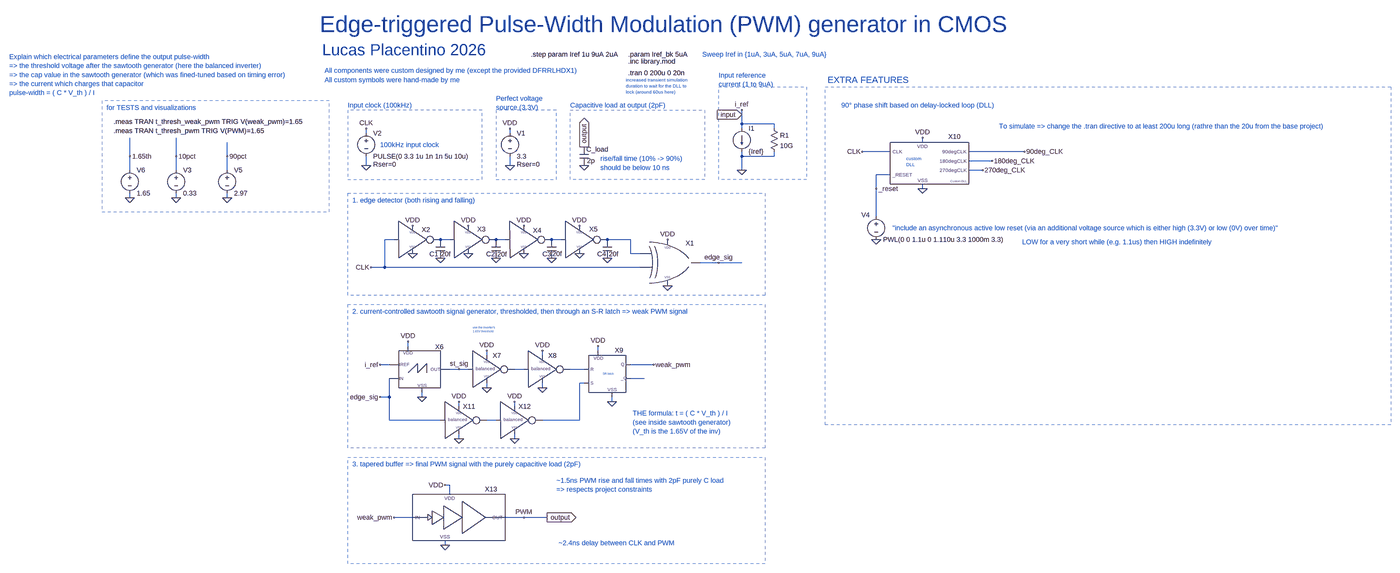
[diagram p0: schematic edge-triggered_PWM_generator.asc, whole sheet]
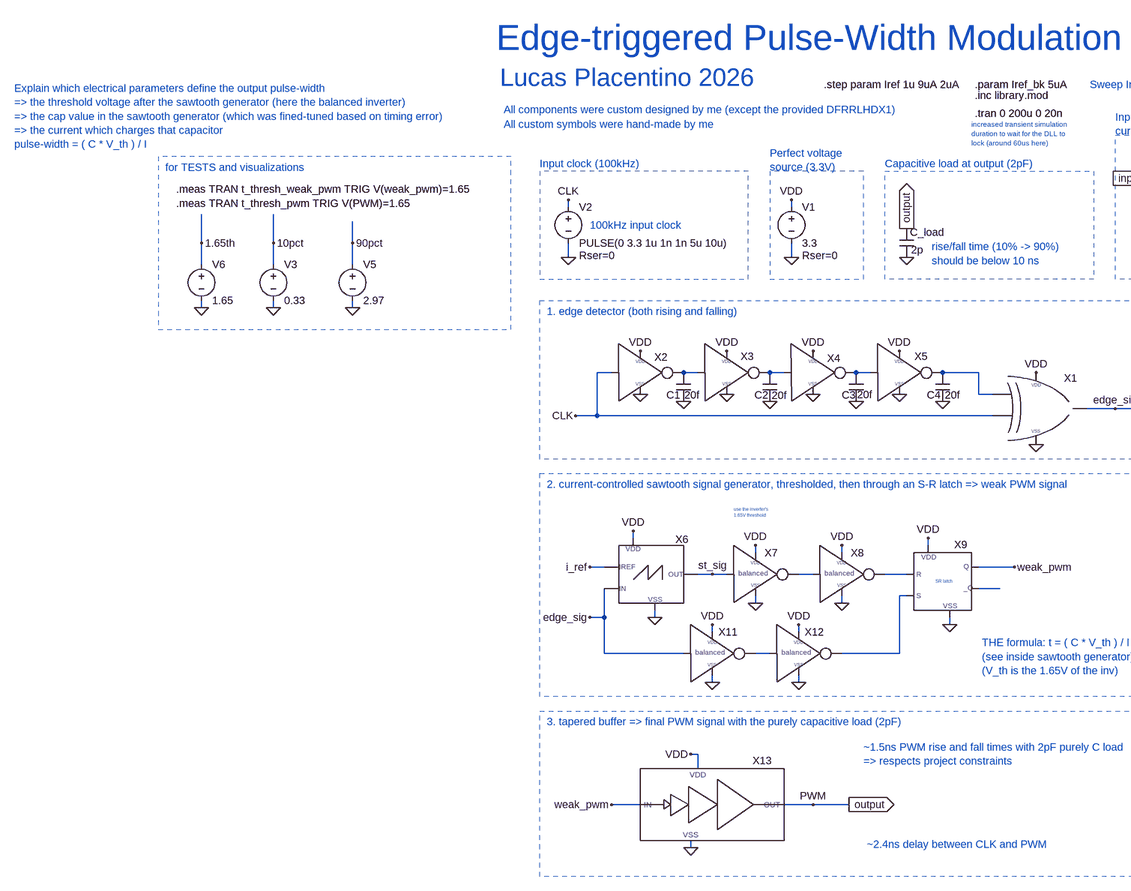
[diagram p1: schematic edge-triggered_PWM_generator.asc, part, row 1 of 1, column 1 of 2]
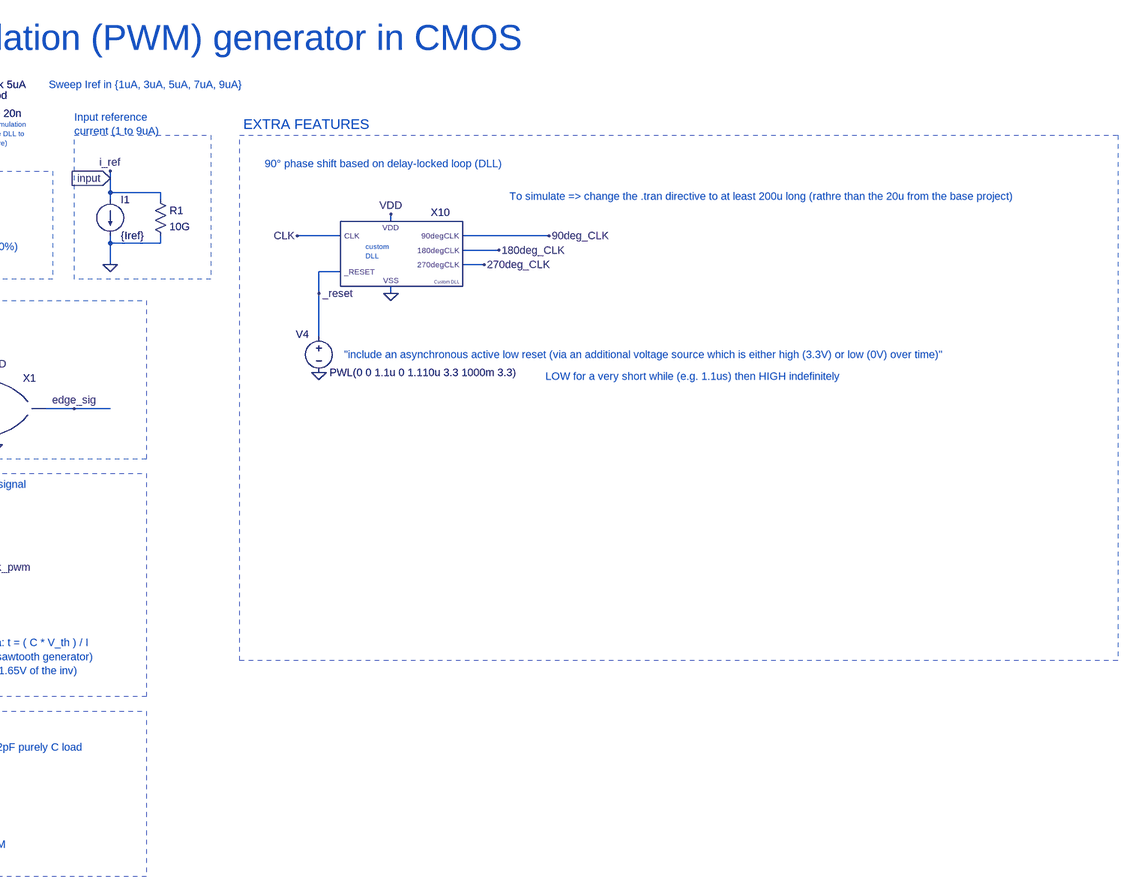
[diagram p2: schematic edge-triggered_PWM_generator.asc, part, row 1 of 1, column 2 of 2]
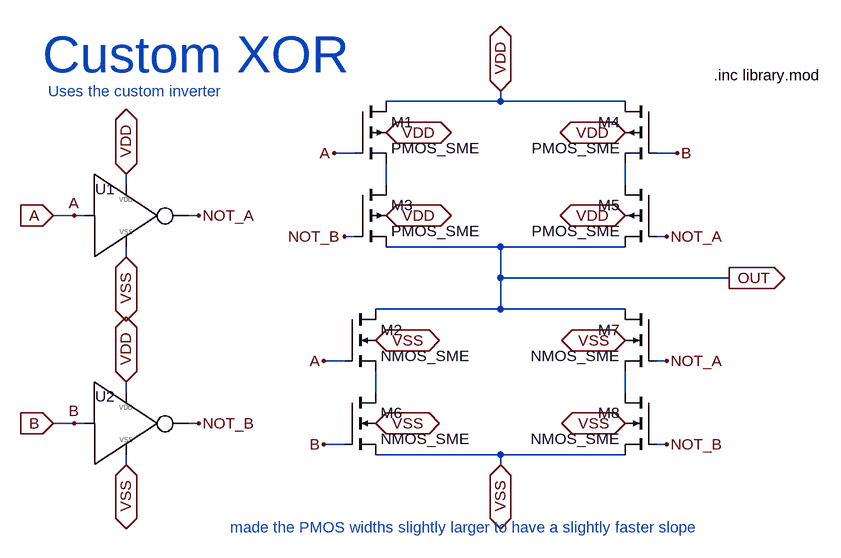
[diagram p3: sub-circuit my_xor.asc]
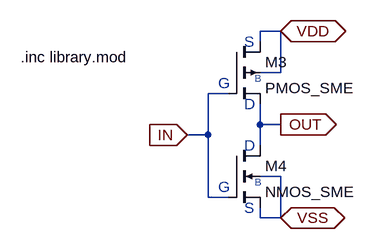
[diagram p4: sub-circuit my_inverter.asc]
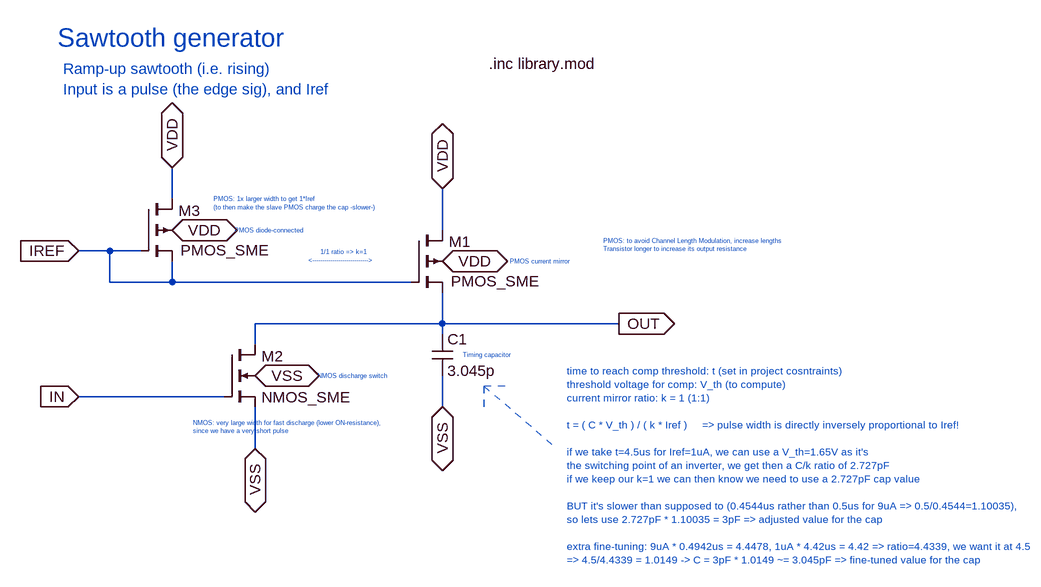
[diagram p5: sub-circuit my_sawtooth_gen.asc]
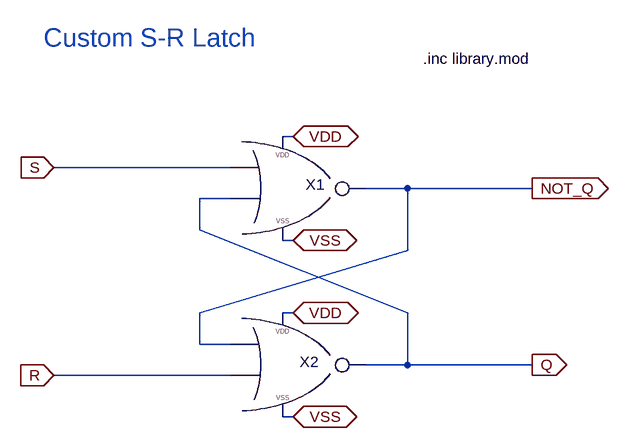
[diagram p6: sub-circuit my_sr_latch.asc]
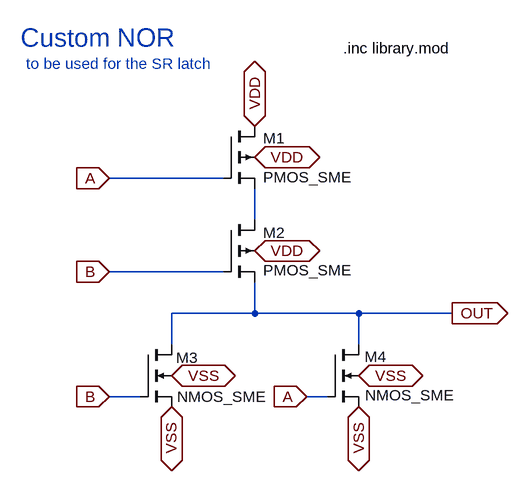
[diagram p7: sub-circuit my_nor.asc]
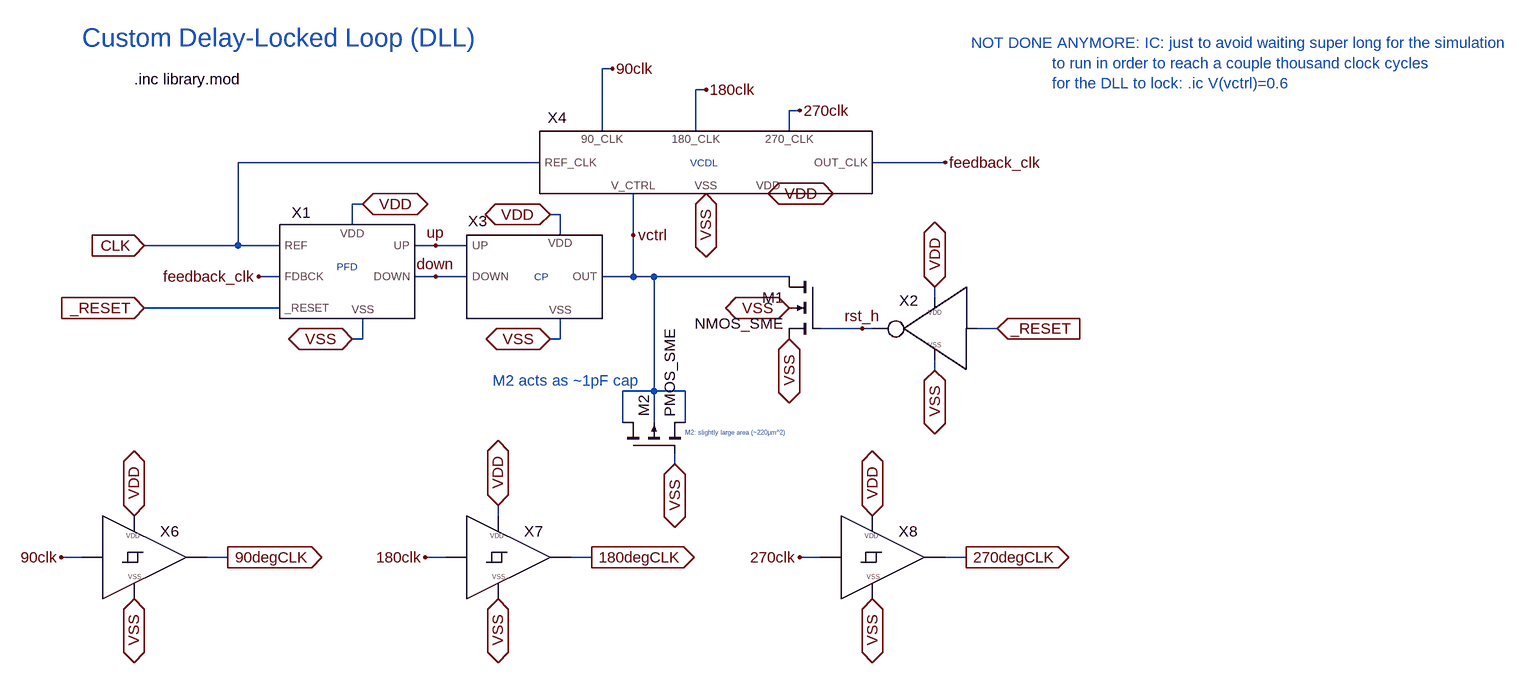
[diagram p8: sub-circuit my_dll.asc]
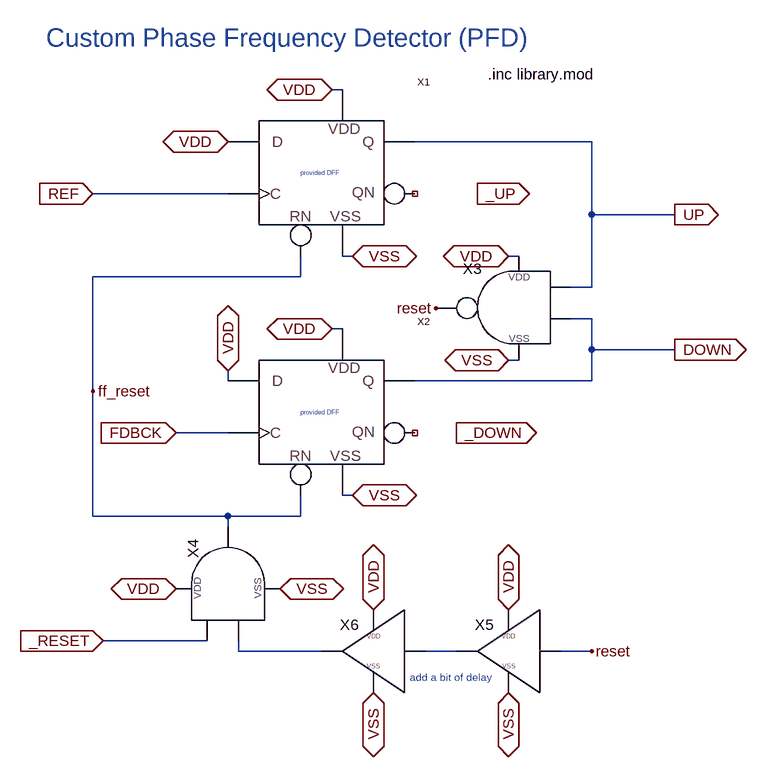
[diagram p9: sub-circuit my_pfd.asc]
edge-triggered_PWM_generator.asc, the LTspice schematic file:
Version 4.1
SHEET 1 2368 1332
WIRE -80 -256 -80 -272
WIRE -80 -224 -80 -256
WIRE 32 -224 -80 -224
WIRE -80 -208 -80 -224
WIRE 32 -208 32 -224
WIRE -1376 -192 -1376 -208
WIRE -880 -192 -880 -208
WIRE 544 -160 544 -176
WIRE 432 -128 336 -128
WIRE 896 -128 704 -128
WIRE -2192 -112 -2192 -176
WIRE -2032 -112 -2032 -176
WIRE -1856 -112 -1856 -160
WIRE -80 -112 -80 -128
WIRE 32 -112 32 -128
WIRE 32 -112 -80 -112
WIRE 784 -96 704 -96
WIRE -1376 -80 -1376 -112
WIRE -880 -80 -880 -112
WIRE -2192 -64 -2192 -112
WIRE -2032 -64 -2032 -112
WIRE -1856 -64 -1856 -112
WIRE -80 -64 -80 -112
WIRE 752 -64 704 -64
WIRE 432 -48 384 -48
WIRE 384 0 384 -48
WIRE 544 0 544 -16
WIRE -2192 32 -2192 16
WIRE -2032 32 -2032 16
WIRE -1856 32 -1856 16
WIRE 384 96 384 0
WIRE -1280 176 -1312 176
WIRE -1088 176 -1120 176
WIRE -896 176 -928 176
WIRE -704 176 -736 176
WIRE -464 176 -544 176
WIRE -464 224 -464 176
WIRE -432 224 -464 224
WIRE -160 256 -224 256
WIRE -80 256 -160 256
WIRE -1312 272 -1312 176
WIRE -1312 272 -1360 272
WIRE -432 272 -1312 272
WIRE -1232 544 -1232 528
WIRE -576 560 -576 544
WIRE -960 576 -960 560
WIRE -768 576 -768 560
WIRE -1296 608 -1328 608
WIRE -384 608 -464 608
WIRE -1056 624 -1088 624
WIRE -1024 624 -1056 624
WIRE -832 624 -864 624
WIRE -624 624 -672 624
WIRE -416 656 -464 656
WIRE -624 672 -640 672
WIRE -960 688 -960 672
WIRE -768 688 -768 672
WIRE -1296 720 -1296 656
WIRE -1296 720 -1328 720
WIRE -1184 720 -1184 704
WIRE -528 736 -528 720
WIRE -1056 752 -1056 736
WIRE -864 752 -864 736
WIRE -1296 800 -1296 720
WIRE -1120 800 -1296 800
WIRE -928 800 -960 800
WIRE -640 800 -640 672
WIRE -640 800 -768 800
WIRE -1056 864 -1056 848
WIRE -864 864 -864 848
WIRE -1088 1024 -1104 1024
WIRE -1088 1056 -1088 1024
WIRE -1216 1136 -1280 1136
WIRE -832 1136 -896 1136
WIRE -752 1136 -832 1136
WIRE -1104 1232 -1104 1216
FLAG -880 -80 0
FLAG -880 -208 VDD
FLAG -1376 -80 0
FLAG -1376 -208 CLK
FLAG -624 -80 0
FLAG -624 -144 output
IOPIN -624 -144 Out
FLAG -80 -256 input
IOPIN -80 -256 In
FLAG -832 224 0
FLAG -640 224 0
FLAG -336 336 0
FLAG -1024 224 0
FLAG -1216 224 0
FLAG -640 128 VDD
FLAG -832 128 VDD
FLAG -1024 128 VDD
FLAG -1216 128 VDD
FLAG -336 176 VDD
FLAG -1360 272 CLK
FLAG -160 256 edge_sig
FLAG -1120 240 0
FLAG -928 240 0
FLAG -736 240 0
FLAG -544 240 0
FLAG -1232 528 VDD
FLAG -1184 720 0
FLAG -960 560 VDD
FLAG -960 688 0
FLAG -80 -272 i_ref
FLAG -80 -64 0
FLAG -1328 608 i_ref
FLAG -1056 624 st_sig
FLAG -1328 720 edge_sig
FLAG -576 544 VDD
FLAG -528 736 0
FLAG -384 608 weak_pwm
FLAG -768 560 VDD
FLAG -768 688 0
FLAG -1280 1136 weak_pwm
FLAG 544 -176 VDD
FLAG 544 0 0
FLAG 336 -128 CLK
FLAG 896 -128 90deg_CLK
FLAG 784 -96 180deg_CLK
FLAG 752 -64 270deg_CLK
FLAG -752 1136 output
IOPIN -752 1136 Out
FLAG 384 0 _reset
FLAG 384 176 0
FLAG -1056 736 VDD
FLAG -1056 864 0
FLAG -864 736 VDD
FLAG -864 864 0
FLAG -1104 1232 0
FLAG -1104 1024 VDD
FLAG -2032 32 0
FLAG -1856 32 0
FLAG -1856 -112 90pct
FLAG -2032 -112 10pct
FLAG -832 1136 PWM
FLAG -2192 32 0
FLAG -2192 -112 1.65th
SYMBOL current -80 -208 R0
WINDOW 123 0 0 Left 0
WINDOW 39 0 0 Left 0
SYMATTR InstName I1
SYMATTR Value {Iref}
SYMBOL voltage -880 -208 R0
WINDOW 123 0 0 Left 0
WINDOW 39 24 124 Left 2
SYMATTR SpiceLine Rser=0
SYMATTR InstName V1
SYMATTR Value 3.3
SYMBOL res 16 -224 R0
SYMATTR InstName R1
SYMATTR Value 10G
SYMBOL voltage -1376 -208 R0
WINDOW 123 0 0 Left 0
WINDOW 39 24 124 Left 2
SYMATTR SpiceLine Rser=0
SYMATTR InstName V2
SYMATTR Value PULSE(0 3.3 1u 1n 1n 5u 10u)
SYMBOL cap -640 -144 R0
WINDOW 3 26 47 Left 2
SYMATTR Value 2p
SYMATTR InstName C_load
SYMBOL my_xor -320 256 R0
SYMATTR InstName X1
SYMBOL my_inverter -1216 176 R0
WINDOW 0 46 -19 Bottom 2
SYMATTR InstName X2
SYMBOL my_inverter -1024 176 R0
WINDOW 0 46 -20 Bottom 2
SYMATTR InstName X3
SYMBOL my_inverter -832 176 R0
WINDOW 0 46 -16 Bottom 2
SYMATTR InstName X4
SYMBOL my_inverter -640 176 R0
WINDOW 0 48 -20 Bottom 2
SYMATTR InstName X5
SYMBOL cap -1136 176 R0
WINDOW 0 -22 50 Left 2
WINDOW 3 18 50 Left 2
SYMATTR InstName C1
SYMATTR Value 20f
SYMBOL cap -944 176 R0
WINDOW 0 -18 50 Left 2
WINDOW 3 20 51 Left 2
SYMATTR InstName C2
SYMATTR Value 20f
SYMBOL cap -752 176 R0
WINDOW 0 -16 50 Left 2
WINDOW 3 18 49 Left 2
SYMATTR InstName C3
SYMATTR Value 20f
SYMBOL cap -560 176 R0
WINDOW 0 -19 50 Left 2
WINDOW 3 21 50 Left 2
SYMATTR InstName C4
SYMATTR Value 20f
SYMBOL my_sawtooth_gen -1200 624 R0
SYMATTR InstName X6
SYMBOL my_sr_latch -544 640 R0
WINDOW 0 41 -66 Bottom 2
SYMATTR InstName X9
SYMBOL voltage 384 80 R0
WINDOW 0 -51 11 Left 2
WINDOW 123 0 0 Left 0
WINDOW 39 0 0 Left 0
SYMATTR InstName V4
SYMATTR Value PWL(0 0 1.1u 0 1.110u 3.3 1000m 3.3)
SYMBOL my_dll 560 -96 R0
SYMATTR InstName X10
SYMBOL my_balanced_inverter -960 624 R0
WINDOW 0 35 -32 Bottom 2
SYMATTR InstName X7
SYMBOL my_balanced_inverter -768 624 R0
WINDOW 0 35 -32 Bottom 2
SYMATTR InstName X8
SYMBOL my_balanced_inverter -1056 800 R0
WINDOW 0 35 -32 Bottom 2
SYMATTR InstName X11
SYMBOL my_balanced_inverter -864 800 R0
WINDOW 0 35 -32 Bottom 2
SYMATTR InstName X12
SYMBOL my_tapered_buffer -1056 1136 R0
SYMATTR InstName X13
SYMBOL voltage -2032 -80 R0
SYMATTR InstName V3
SYMATTR Value 0.33
SYMBOL voltage -1856 -80 R0
SYMATTR InstName V5
SYMATTR Value 2.97
SYMBOL voltage -2192 -80 R0
SYMATTR InstName V6
SYMATTR Value 1.65
TEXT -472 -464 Left 2 !.param Iref_bk 5uA
TEXT -472 -440 Left 2 !.inc library.mod
TEXT -472 -400 Left 2 !.tran 0 200u 0 20n
TEXT -1536 -568 Left 6 ;Edge-triggered Pulse-Width Modulation (PWM) generator in CMOS
TEXT -568 -104 Left 2 ;rise/fall time (10% -> 90%)\nshould be below 10 ns
TEXT -216 -464 Left 2 ;Sweep Iref in {1uA, 3uA, 5uA, 7uA, 9uA}
TEXT -2608 -456 Left 2 ;Explain which electrical parameters define the output pulse-width\n=> the threshold voltage after the sawtooth generator (here the balanced inverter)\n=> the cap value in the sawtooth generator (which was fined-tuned based on timing error)\n=> the current which charges that capacitor\npulse-width = ( C * V_th ) / I
TEXT -1328 -152 Left 2 ;100kHz input clock
TEXT -1528 -480 Left 5 ;Lucas Placentino 2026
TEXT -1424 40 Left 2 ;1. edge detector (both rising and falling)
TEXT -1424 424 Left 2 ;2. current-controlled sawtooth signal generator, thresholded, then through an S-R latch => weak PWM signal
TEXT -560 640 Left 0 ;SR latch
TEXT -1424 952 Left 2 ;3. tapered buffer => final PWM signal with the purely capacitive load (2pF)
TEXT -1440 -288 Left 2 ;Input clock (100kHz)
TEXT -928 -312 Left 2 ;Perfect voltage \nsource (3.3V)
TEXT -672 -288 Left 2 ;Capacitive load at output (2pF)
TEXT -160 -392 Left 2 ;Input reference \ncurrent (1 to 9uA)
TEXT 264 -288 Left 2 ;90° phase shift based on delay-locked loop (DLL)
TEXT 488 -104 Left 1 ;custom\nDLL
TEXT 216 -376 Left 3 ;EXTRA FEATURES
TEXT 440 136 Left 2 ;"include an asynchronous active low reset (via an additional voltage source which is either high (3.3V) or low (0V) over time)"
TEXT -1008 480 Left 0 ;use the inverter's\n1.65V threshold
TEXT 888 184 Left 2 ;LOW for a very short while (e.g. 1.1us) then HIGH indefinitely
TEXT -808 -464 Left 2 !.step param Iref 1u 9uA 2uA
TEXT -2248 -232 Left 2 !.meas TRAN t_thresh_weak_pwm TRIG V(weak_pwm)=1.65
TEXT -456 776 Left 2 ;THE formula: t = ( C * V_th ) / I\n(see inside sawtooth generator)\n(V_th is the 1.65V of the inv)
TEXT -720 1008 Left 2 ;~1.5ns PWM rise and fall times with 2pF purely C load\n=> respects project constraints
TEXT -2272 -280 Left 2 ;for TESTS and visualizations
TEXT 808 -216 Left 2 ;To simulate => change the .tran directive to at least 200u long (rathre than the 20u from the base project)
TEXT -712 1224 Left 2 ;~2.4ns delay between CLK and PWM
TEXT -2248 -200 Left 2 !.meas TRAN t_thresh_pwm TRIG V(PWM)=1.65
TEXT -1520 -376 Left 2 ;All custom symbols were hand-made by me
TEXT -1520 -408 Left 2 ;All components were custom designed by me (except the provided DFRRLHDX1)
TEXT -480 -376 Left 1 ;increased transient simulation \nduration to wait for the DLL to\nlock (around 60us here)
RECTANGLE Normal -1440 -32 -976 -272 2
RECTANGLE Normal -208 -32 -672 -272 2
RECTANGLE Normal 144 -32 -160 -352 2
RECTANGLE Normal -928 -32 -720 -272 2
RECTANGLE Normal 0 368 -1440 16 2
RECTANGLE Normal 0 896 -1440 400 2
RECTANGLE Normal 2160 816 208 -352 2
RECTANGLE Normal 0 1296 -1440 928 2
RECTANGLE Normal -2288 80 -1504 -304 2

The netlist it stands for:
* edge-triggered_PWM_generator.asc
I1 i_ref 0 {Iref}
V1 VDD 0 3.3 Rser=0
R1 i_ref 0 10G
V2 CLK 0 PULSE(0 3.3 1u 1n 1n 5u 10u) Rser=0
C_load PWM 0 2p
X§X1 N004 CLK edge_sig VDD 0 my_xor
X§X2 CLK N001 VDD 0 my_inverter
X§X3 N001 N002 VDD 0 my_inverter
X§X4 N002 N003 VDD 0 my_inverter
X§X5 N003 N004 VDD 0 my_inverter
C1 N001 0 20f
C2 N002 0 20f
C3 N003 0 20f
C4 N004 0 20f
X§X6 edge_sig i_ref st_sig VDD 0 my_sawtooth_gen
X§X9 N006 N008 N007 weak_pwm VDD 0 my_sr_latch
V4 _reset 0 PWL(0 0 1.1u 0 1.110u 3.3 1000m 3.3)
X§X10 _reset CLK 180deg_CLK 270deg_CLK 90deg_CLK VDD 0 my_dll
X§X7 st_sig N005 VDD 0 my_balanced_inverter
X§X8 N005 N006 VDD 0 my_balanced_inverter
X§X11 edge_sig N009 VDD 0 my_balanced_inverter
X§X12 N009 N008 VDD 0 my_balanced_inverter
X§X13 weak_pwm PWM VDD 0 my_tapered_buffer
V3 10pct 0 0.33
V5 90pct 0 2.97
V6 1.65th 0 1.65

* block symbol definitions
.subckt my_xor A B OUT VDD VSS
M1 VDD A N001 VDD PMOS_SME l=0.35u w=1u
M2 OUT A N003 VSS NMOS_SME l=0.35u w=0.4u
X§U1 A NOT_A VDD VSS my_inverter
X§U2 B NOT_B VDD VSS my_inverter
M3 N001 NOT_B OUT VDD PMOS_SME l=0.35u w=1u
M4 VDD B N002 VDD PMOS_SME l=0.35u w=1u
M5 N002 NOT_A OUT VDD PMOS_SME l=0.35u w=1u
M6 N003 B VSS VSS NMOS_SME l=0.35u w=0.4u
M7 OUT NOT_A N004 VSS NMOS_SME l=0.35u w=0.4u
M8 N004 NOT_B VSS VSS NMOS_SME l=0.35u w=0.4u
* Custom XOR
* Uses the custom inverter
.inc library.mod
* made the PMOS widths slightly larger to have a slightly faster slope
.ends my_xor

.subckt my_inverter IN OUT VDD VSS
M3 VDD IN OUT VDD PMOS_SME l=0.35u w=0.4u
M4 OUT IN VSS VSS NMOS_SME l=0.35u w=0.4u
* S
* S
* D
* D
* G
* G
* B
* B
.inc library.mod
.ends my_inverter

.subckt my_sawtooth_gen IN IREF OUT VDD VSS
C1 OUT VSS 3.045p
M2 OUT IN VSS VSS NMOS_SME l=0.35u w=20u
M3 VDD IREF IREF VDD PMOS_SME l=10u w=2u
M1 VDD IREF OUT VDD PMOS_SME l=10u w=2u
* Sawtooth generator
* Ramp-up sawtooth (i.e. rising)
* Input is a pulse (the edge sig), and Iref
* PMOS current mirror
* Timing capacitor
* NMOS discharge switch
* PMOS diode-connected
.inc library.mod
* NMOS: very large width for fast discharge (lower ON-resistance),
* since we have a very short pulse
* PMOS: 1x larger width to get 1*Iref
* (to then make the slave PMOS charge the cap -slower-)
* PMOS: to avoid Channel Length Modulation, increase lengths
* Transistor longer to increase its output resistance
* time to reach comp threshold: t (set in project cosntraints)
* threshold voltage for comp: V_th (to compute)
* current mirror ratio: k = 1 (1:1)
* t = ( C * V_th ) / ( k * Iref )     => pulse width is directly inversely proportional to Iref!
* if we take t=4.5us for Iref=1uA, we can use a V_th=1.65V as it's
* the switching point of an inverter, we get then a C/k ratio of 2.727pF
* if we keep our k=1 we can then know we need to use a 2.727pF cap value
* BUT it's slower than supposed to (0.4544us rather than 0.5us for 9uA => 0.5/0.4544=1.10035),
* so lets use 2.727pF * 1.10035 = 3pF => adjusted value for the cap
* extra fine-tuning: 9uA * 0.4942us = 4.4478, 1uA * 4.42us = 4.42 => ratio=4.4339, we want it at 4.5
* => 4.5/4.4339 = 1.0149 -> C = 3pF * 1.0149 ~= 3.045pF => fine-tuned value for the cap
* 1/1 ratio => k=1
* <---------------------------->
.ends my_sawtooth_gen

.subckt my_sr_latch R S NOT_Q Q VDD VSS
X§X1 S Q NOT_Q VDD VSS my_nor
X§X2 NOT_Q R Q VDD VSS my_nor
* Custom S-R Latch
.inc library.mod
.ends my_sr_latch

.subckt my_nor A B OUT VDD VSS
M1 VDD A N001 VDD PMOS_SME l=0.35u w=0.4u
M2 N001 B OUT VDD PMOS_SME l=0.35u w=0.4u
M3 OUT B VSS VSS NMOS_SME l=0.35u w=0.4u
M4 OUT A VSS VSS NMOS_SME l=0.35u w=0.4u
* Custom NOR
.inc library.mod
* to be used for the SR latch
.ends my_nor

.subckt my_dll _RESET CLK 180degCLK 270degCLK 90degCLK VDD VSS
X§X1 feedback_clk CLK down up VDD VSS _RESET my_pfd
X§X3 down up vctrl VDD VSS my_cp
M1 vctrl rst_h VSS VSS NMOS_SME l=0.35u w=0.4u
X§X2 _RESET rst_h VDD VSS my_inverter
X§X4 CLK vctrl 180clk 270clk 90clk feedback_clk VDD VSS my_vcdl
X§X6 90clk 90degCLK VDD VSS my_schmitt_trigger
X§X7 180clk 180degCLK VDD VSS my_schmitt_trigger
X§X8 270clk 270degCLK VDD VSS my_schmitt_trigger
M2 vctrl VSS vctrl vctrl PMOS_SME l=10u w=22u
* Custom Delay-Locked Loop (DLL)
.inc library.mod
* PFD
* CP
* VCDL
* NOT DONE ANYMORE: IC: just to avoid waiting super long for the simulation
*                   to run in order to reach a couple thousand clock cycles
*                   for the DLL to lock: .ic V(vctrl)=0.6
* M2 acts as ~1pF cap
* M2: slightly large area (~220μm^2)
.ends my_dll

.subckt my_pfd FDBCK REF DOWN UP VDD VSS _RESET
X§X1 VDD REF ff_reset NC_01 UP VDD VSS DFRRLHDX1  ; pins D C RN QN Q VDD VSS
X§X2 VDD FDBCK ff_reset NC_02 DOWN VDD VSS DFRRLHDX1  ; pins D C RN QN Q VDD VSS
X§X3 UP DOWN reset VDD VSS my_nand
X§X4 _RESET N001 ff_reset VDD VSS my_and
X§X5 reset N002 VDD VSS my_buffer
X§X6 N002 N001 VDD VSS my_buffer
* Custom Phase Frequency Detector (PFD)
.inc library.mod
* provided DFF
* provided DFF
* add a bit of delay
.ends my_pfd

.subckt my_nand A B OUT VDD VSS
M1 N001 B VSS VSS NMOS_SME l=0.35u w=0.4u
M2 VDD A OUT VDD PMOS_SME l=0.35u w=0.4u
M3 VDD B OUT VDD PMOS_SME l=0.35u w=0.4u
M4 OUT A N001 VSS NMOS_SME l=0.35u w=0.4u
* Custom NAND gate
.inc library.mod
.ends my_nand

.subckt my_and A B OUT VDD VSS
X§X1 A B N001 VDD VSS my_nand
X§X2 N001 OUT VDD VSS my_inverter
* Custom AND gate
.inc library.mod
.ends my_and

.subckt my_buffer IN OUT VDD VSS
X§X1 IN N001 VDD VSS my_inverter
X§X2 N001 OUT VDD VSS my_inverter
* Custom buffer
.ends my_buffer

.subckt my_cp DOWN UP OUT VDD VSS
M1 VDD N001 N002 VDD PMOS_SME l=5u w=0.8u
M2 OUT DOWN_delayed N004 VSS NMOS_SME l=0.35u w=0.4u
M3 N002 N003 OUT VDD PMOS_SME l=0.35u w=0.4u
M4 N004 iref VSS VSS NMOS_SME l=5u w=0.4u
M5 VDD N001 N001 VDD PMOS_SME l=5u w=16u
M6 N001 iref VSS VSS NMOS_SME l=5u w=8u
M7 iref iref VSS VSS NMOS_SME l=5u w=8u
X§X1 UP N003 VDD VSS my_inverter
M8 iref VSS VDD VDD PMOS_SME l=50u w=0.4u
M9 DOWN VDD DOWN_delayed VSS NMOS_SME l=0.35u w=0.4u
M10 DOWN VSS DOWN_delayed VDD PMOS_SME l=0.35u w=0.4u
* Custom Charge Pump (CP)
.inc library.mod
* diode-connected
* 1/20 ratio
* <------------------>
* 1/20 ratio
* <------------------>
* ref gen
* (acts as a resistor)
* small current source (hundreds of nA?)
* Note: rather long PMOS M8 (~50u) in order
* to get small current source/ref for this CP
* tiny bit of delay to compensate
* the inverter on UP so that they're
* in sync
.ends my_cp

.subckt my_vcdl REF_CLK V_CTRL 180_CLK 270_CLK 90_CLK OUT_CLK VDD VSS
M9 VDD VBP VBP VDD PMOS_SME l=2u w=2u
M10 VBP V_CTRL VSS VSS NMOS_SME l=2u w=0.4u
X§X1 REF_CLK cap_1_1 VDD VSS VBP VBN my_current_starved_inverter
X§X2 90_CLK cap_2_1 VDD VSS VBP VBN my_current_starved_inverter
X§X3 180_CLK cap_3_1 VDD VSS VBP VBN my_current_starved_inverter
X§X4 270_CLK cap_4_1 VDD VSS VBP VBN my_current_starved_inverter
X§X5 cap_1_1 cap_1_2 VDD VSS VBP VBN my_current_starved_inverter
X§X6 cap_2_1 cap_2_2 VDD VSS VBP VBN my_current_starved_inverter
X§X7 cap_3_1 cap_3_2 VDD VSS VBP VBN my_current_starved_inverter
X§X8 cap_4_1 cap_4_2 VDD VSS VBP VBN my_current_starved_inverter
X§X9 cap_1_2 90_CLK VDD VSS my_schmitt_trigger
X§X10 cap_2_2 180_CLK VDD VSS my_schmitt_trigger
X§X11 cap_3_2 270_CLK VDD VSS my_schmitt_trigger
X§X12 cap_4_2 OUT_CLK VDD VSS my_schmitt_trigger
M11 VBN VBN VSS VSS NMOS_SME l=2u w=0.4u
M12 VDD VBP VBN VDD PMOS_SME l=2u w=2u
M4 VSS cap_1_1 VSS VSS NMOS_SME l={CAP_L} w={CAP_W}
M1 VSS cap_1_2 VSS VSS NMOS_SME l={CAP_L} w={CAP_W}
M2 VSS cap_2_1 VSS VSS NMOS_SME l={CAP_L} w={CAP_W}
M3 VSS cap_2_2 VSS VSS NMOS_SME l={CAP_L} w={CAP_W}
M5 VSS cap_3_1 VSS VSS NMOS_SME l={CAP_L} w={CAP_W}
M6 VSS cap_3_2 VSS VSS NMOS_SME l={CAP_L} w={CAP_W}
M7 VSS cap_4_1 VSS VSS NMOS_SME l={CAP_L} w={CAP_W}
M8 VSS cap_4_2 VSS VSS NMOS_SME l={CAP_L} w={CAP_W}
* Custom Voltage-Controlled Delay Line (VCDL)
.inc library.mod
* TA advice: add another non-starved inverter to get back into a digital signal ? or just at the end ?
* 4x Non-Inverting Delay Elements (two current-starved inverters followed by a Schmitt trigger)
* bias voltage generator for the current-starved inverters
* slightly large area (~110μm^2)
* acts as ~500fF cap
* slightly large area (~110μm^2)
* acts as ~500fF cap
* slightly large area (~110μm^2)
* acts as ~500fF cap
* slightly large area (~110μm^2)
* acts as ~500fF cap
* slightly large area (~110μm^2)
* acts as ~500fF cap
* slightly large area (~110μm^2)
* acts as ~500fF cap
* slightly large area (~110μm^2)
* acts as ~500fF cap
* slightly large area (~110μm^2)
* acts as ~500fF cap
.param CAP_L=10u CAP_W=11u
* capacitors for extra delay
.ends my_vcdl

.subckt my_current_starved_inverter IN OUT VDD VSS VBP VBN
M3 N002 IN OUT VDD PMOS_SME l=0.35u w=1.2u
M4 OUT IN N003 VSS NMOS_SME l=0.35u w=0.4u
M1 N001 VBP N002 VDD PMOS_SME l=2u w=2.35u
M2 N003 VBN N004 VSS NMOS_SME l=2u w=0.4u
M5 N004 VBN VSS VSS NMOS_SME l=2u w=0.4u
M6 VDD VBP N001 VDD PMOS_SME l=2u w=2.35u
* S
* S
* D
* D
* G
* G
* B
* B
.inc library.mod
* Custom current-starved inverter
* cascode? -> output resistance increases (from $r_o$ to roughly $g_m \cdot r_o^2$ ?)
* cascode? -> output resistance increases (from $r_o$ to roughly $g_m \cdot r_o^2$ ?)
* starvation pmos
* starvation nmos
.ends my_current_starved_inverter

.subckt my_schmitt_trigger IN OUT VDD VSS
M1 VDD IN N001 VDD PMOS_SME l=0.35u w=2u
M2 n_inv IN N002 VSS NMOS_SME l=0.35u w=1u
M3 N001 IN n_inv VDD PMOS_SME l=0.35u w=2u
M4 N002 IN VSS VSS NMOS_SME l=0.35u w=1u
M5 VSS n_inv N001 VDD PMOS_SME l=0.35u w=0.8u
M6 N002 n_inv VDD VSS NMOS_SME l=0.35u w=0.4u
X§X1 n_inv OUT VDD VSS my_inverter
* Custom Schmitt trigger
.inc library.mod
* /!\
* /!\
* not VDD
* not VSS
.ends my_schmitt_trigger

.subckt my_balanced_inverter IN OUT VDD VSS
M3 VDD IN OUT VDD PMOS_SME l=0.35u w=1u
M4 OUT IN VSS VSS NMOS_SME l=0.35u w=0.4u
* S
* S
* D
* D
* G
* G
* B
* B
.inc library.mod
.ends my_balanced_inverter

.subckt my_tapered_buffer IN OUT VDD VSS
M1 VDD IN N001 VDD PMOS_SME l=0.35u w=5u
M2 N001 IN VSS VSS NMOS_SME l=0.35u w=2u
M3 VDD N001 OUT VDD PMOS_SME l=0.35u w=25u
M4 OUT N001 VSS VSS NMOS_SME l=0.35u w=10u
* Custom Tapered Buffer
.inc library.mod
* Just a series of (balanced) inverters increasing in size.
* 5x increase between stages (x5 from weak_pwm aka s-r latch output, x25 for second stage here)
.ends my_tapered_buffer

.model NMOS NMOS
.model PMOS PMOS
.lib standard.mos
.param Iref_bk 5uA
.inc library.mod
.tran 0 200u 0 20n
* Edge-triggered Pulse-Width Modulation (PWM) generator in CMOS
* rise/fall time (10% -> 90%)
* should be below 10 ns
* Sweep Iref in {1uA, 3uA, 5uA, 7uA, 9uA}
* Explain which electrical parameters define the output pulse-width
* => the threshold voltage after the sawtooth generator (here the balanced inverter)
* => the cap value in the sawtooth generator (which was fined-tuned based on timing error)
* => the current which charges that capacitor
* pulse-width = ( C * V_th ) / I
* 100kHz input clock
* Lucas Placentino 2026
* 1. edge detector (both rising and falling)
* 2. current-controlled sawtooth signal generator, thresholded, then through an S-R latch => weak PWM signal
* SR latch
* 3. tapered buffer => final PWM signal with the purely capacitive load (2pF)
* Input clock (100kHz)
* Perfect voltage
* source (3.3V)
* Capacitive load at output (2pF)
* Input reference
* current (1 to 9uA)
* 90° phase shift based on delay-locked loop (DLL)
* custom
* DLL
* EXTRA FEATURES
* "include an asynchronous active low reset (via an additional voltage source which is either high (3.3V) or low (0V) over time)"
* use the inverter's
* 1.65V threshold
* LOW for a very short while (e.g. 1.1us) then HIGH indefinitely
.step param Iref 1u 9uA 2uA
.meas TRAN t_thresh_weak_pwm TRIG V(weak_pwm)=1.65
* THE formula: t = ( C * V_th ) / I
* (see inside sawtooth generator)
* (V_th is the 1.65V of the inv)
* ~1.5ns PWM rise and fall times with 2pF purely C load
* => respects project constraints
* for TESTS and visualizations
* To simulate => change the .tran directive to at least 200u long (rathre than the 20u from the base project)
* ~2.4ns delay between CLK and PWM
.meas TRAN t_thresh_pwm TRIG V(PWM)=1.65
* All custom symbols were hand-made by me
* All components were custom designed by me (except the provided DFRRLHDX1)
* increased transient simulation
* duration to wait for the DLL to
* lock (around 60us here)
.backanno
.end